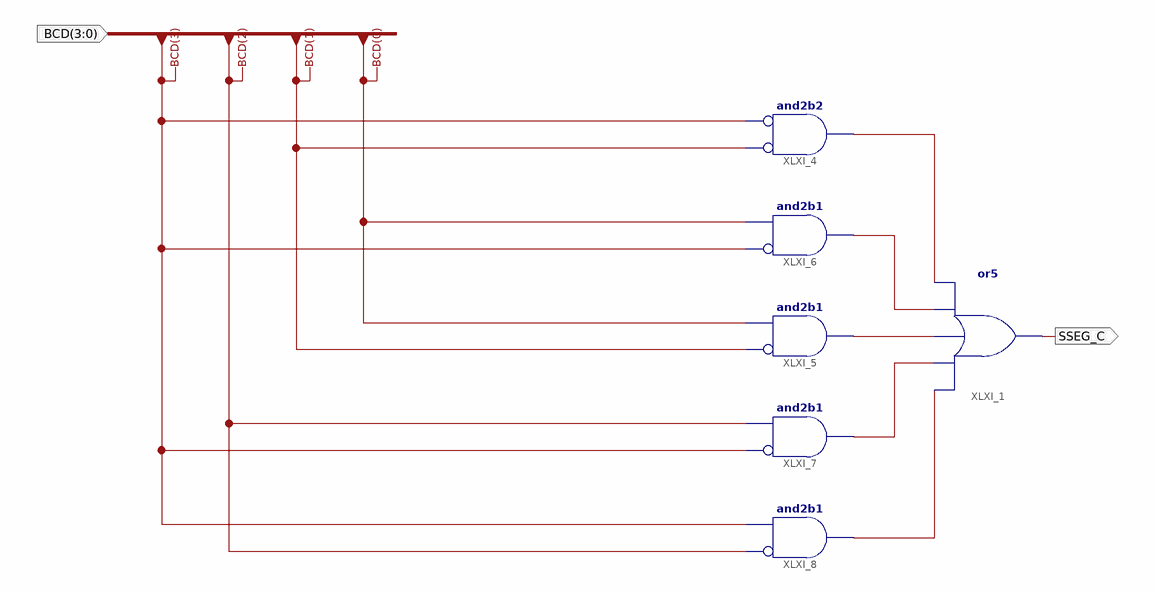
[diagram p0: schematic sheet 1]
// Xilinx ISE schematic SSEG_C.sch (spartan6) as structural Verilog: 6 symbols, 2 ports
module SSEG_C (
  input  [3:0] BCD,
  output SSEG_C
);

  wire XLXN_14, XLXN_15, XLXN_16, XLXN_17, XLXN_18;

  or XLXI_1 (SSEG_C, XLXN_18, XLXN_17, XLXN_16, XLXN_15, XLXN_14);
  and XLXI_4 (XLXN_14, ~BCD[1], ~BCD[3]);  // and2b2
  and XLXI_5 (XLXN_16, ~BCD[1], BCD[0]);  // and2b1
  and XLXI_6 (XLXN_15, ~BCD[3], BCD[0]);  // and2b1
  and XLXI_7 (XLXN_17, ~BCD[3], BCD[2]);  // and2b1
  and XLXI_8 (XLXN_18, ~BCD[2], BCD[3]);  // and2b1
endmodule
